# EAGLE board Negibus (EAGLE 6.6.0), part 1 of 2
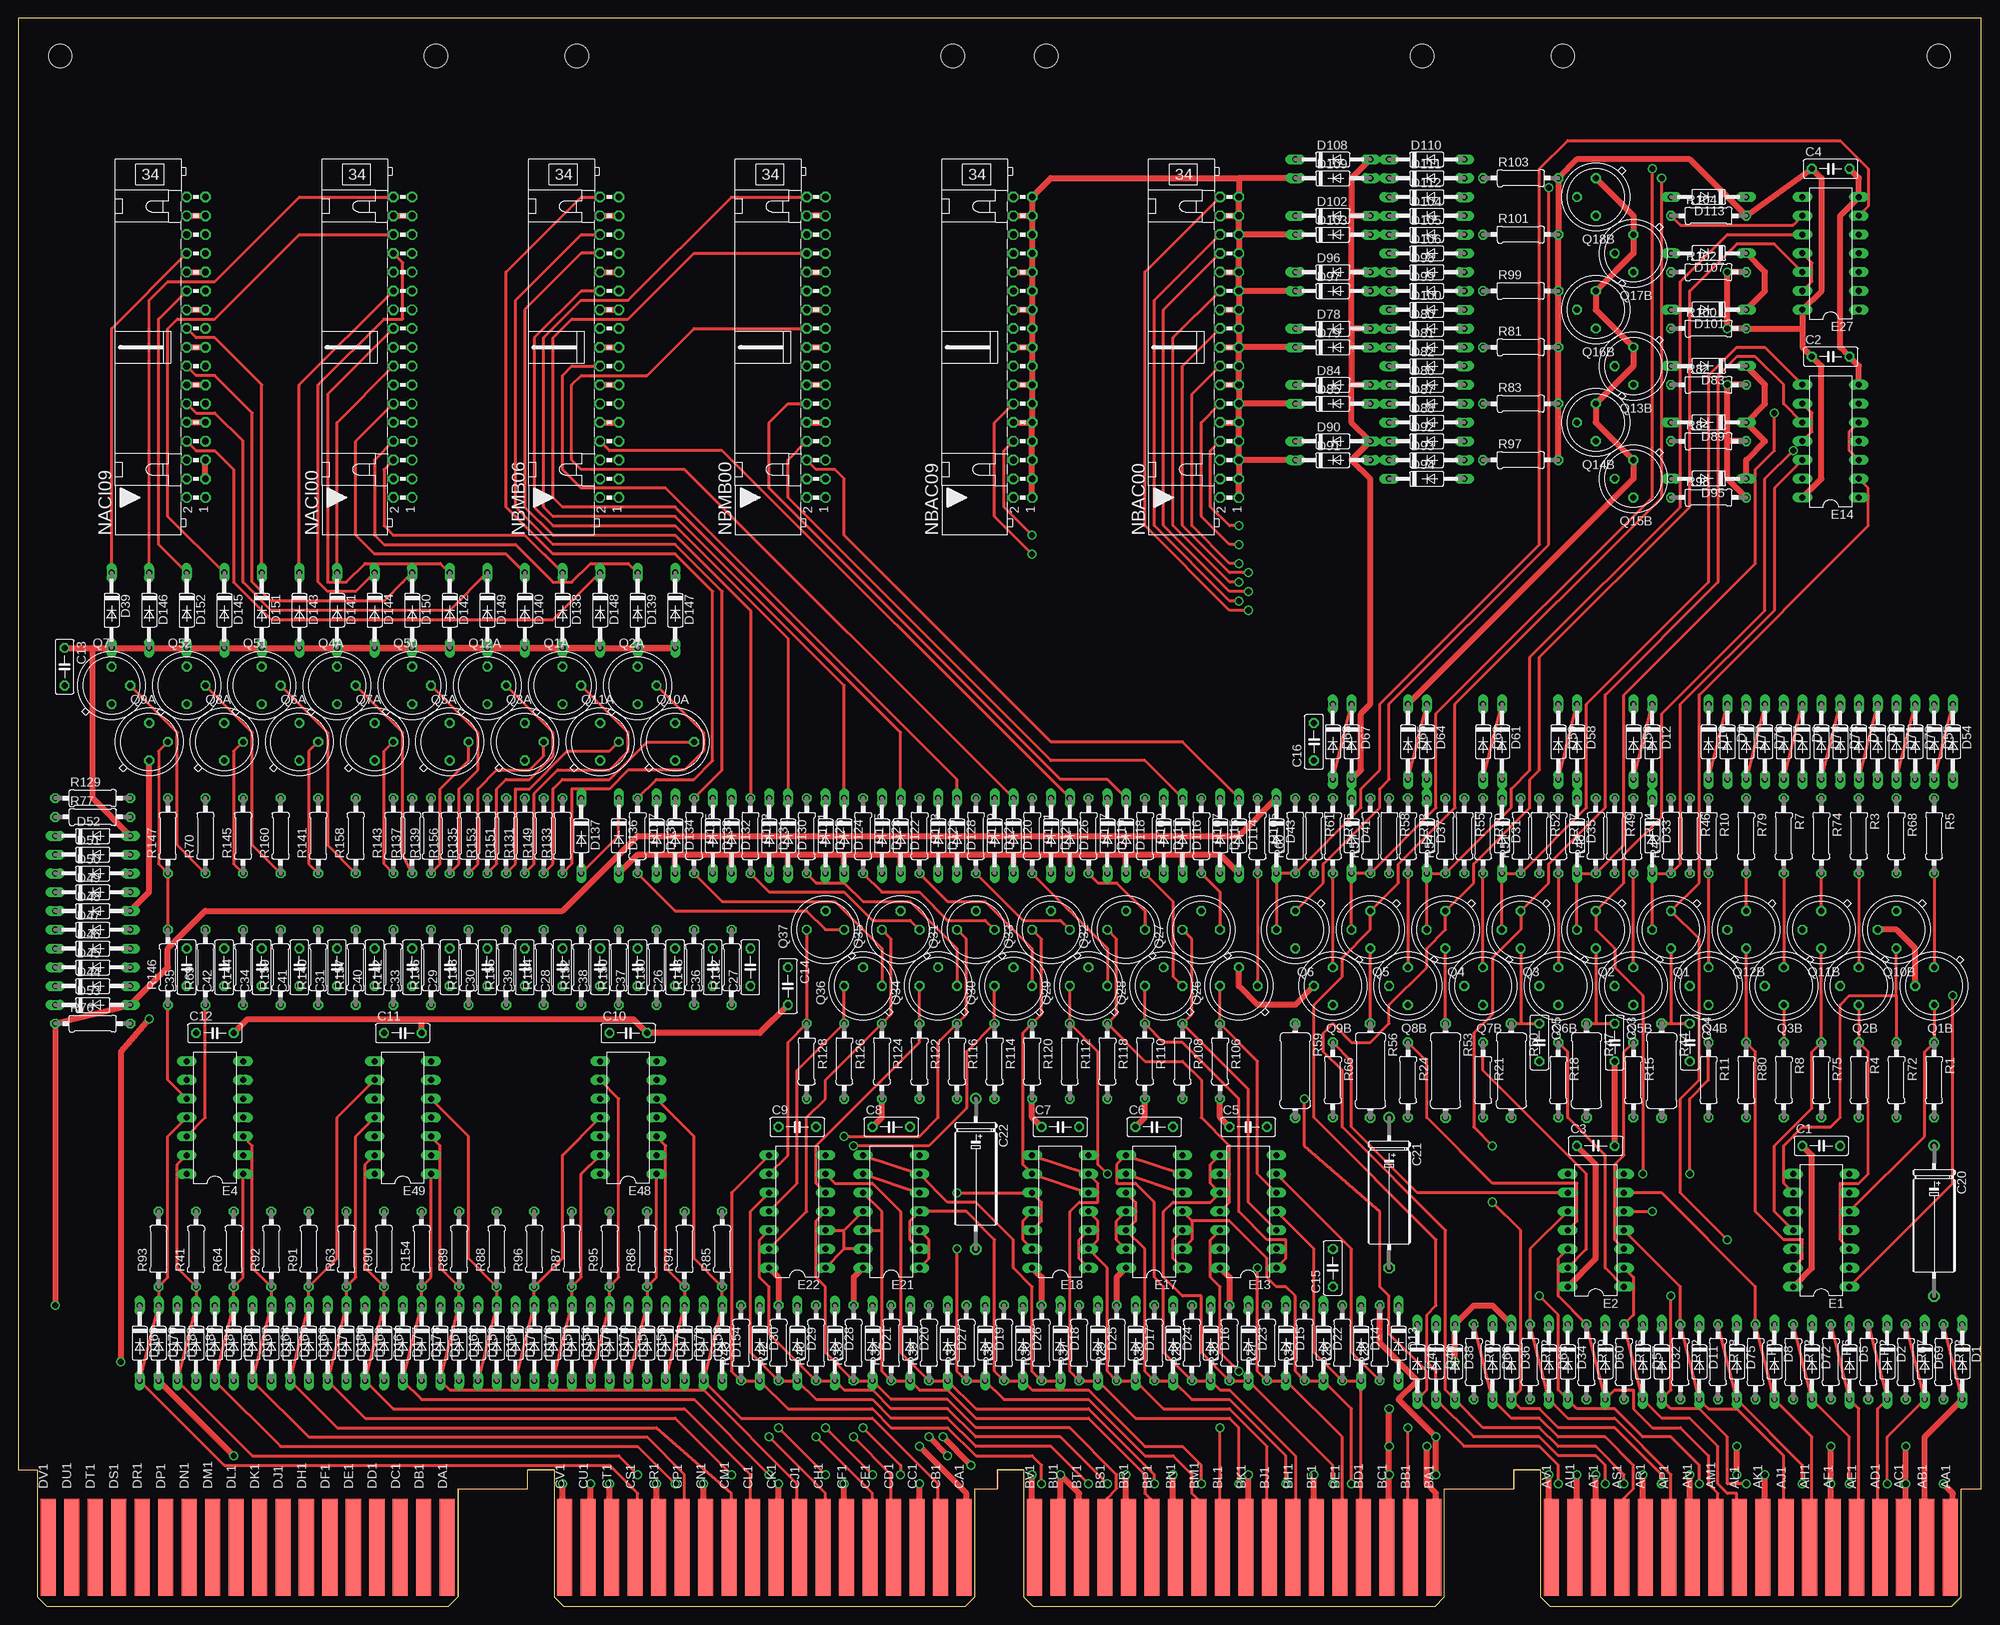
[diagram p4: board, top side]
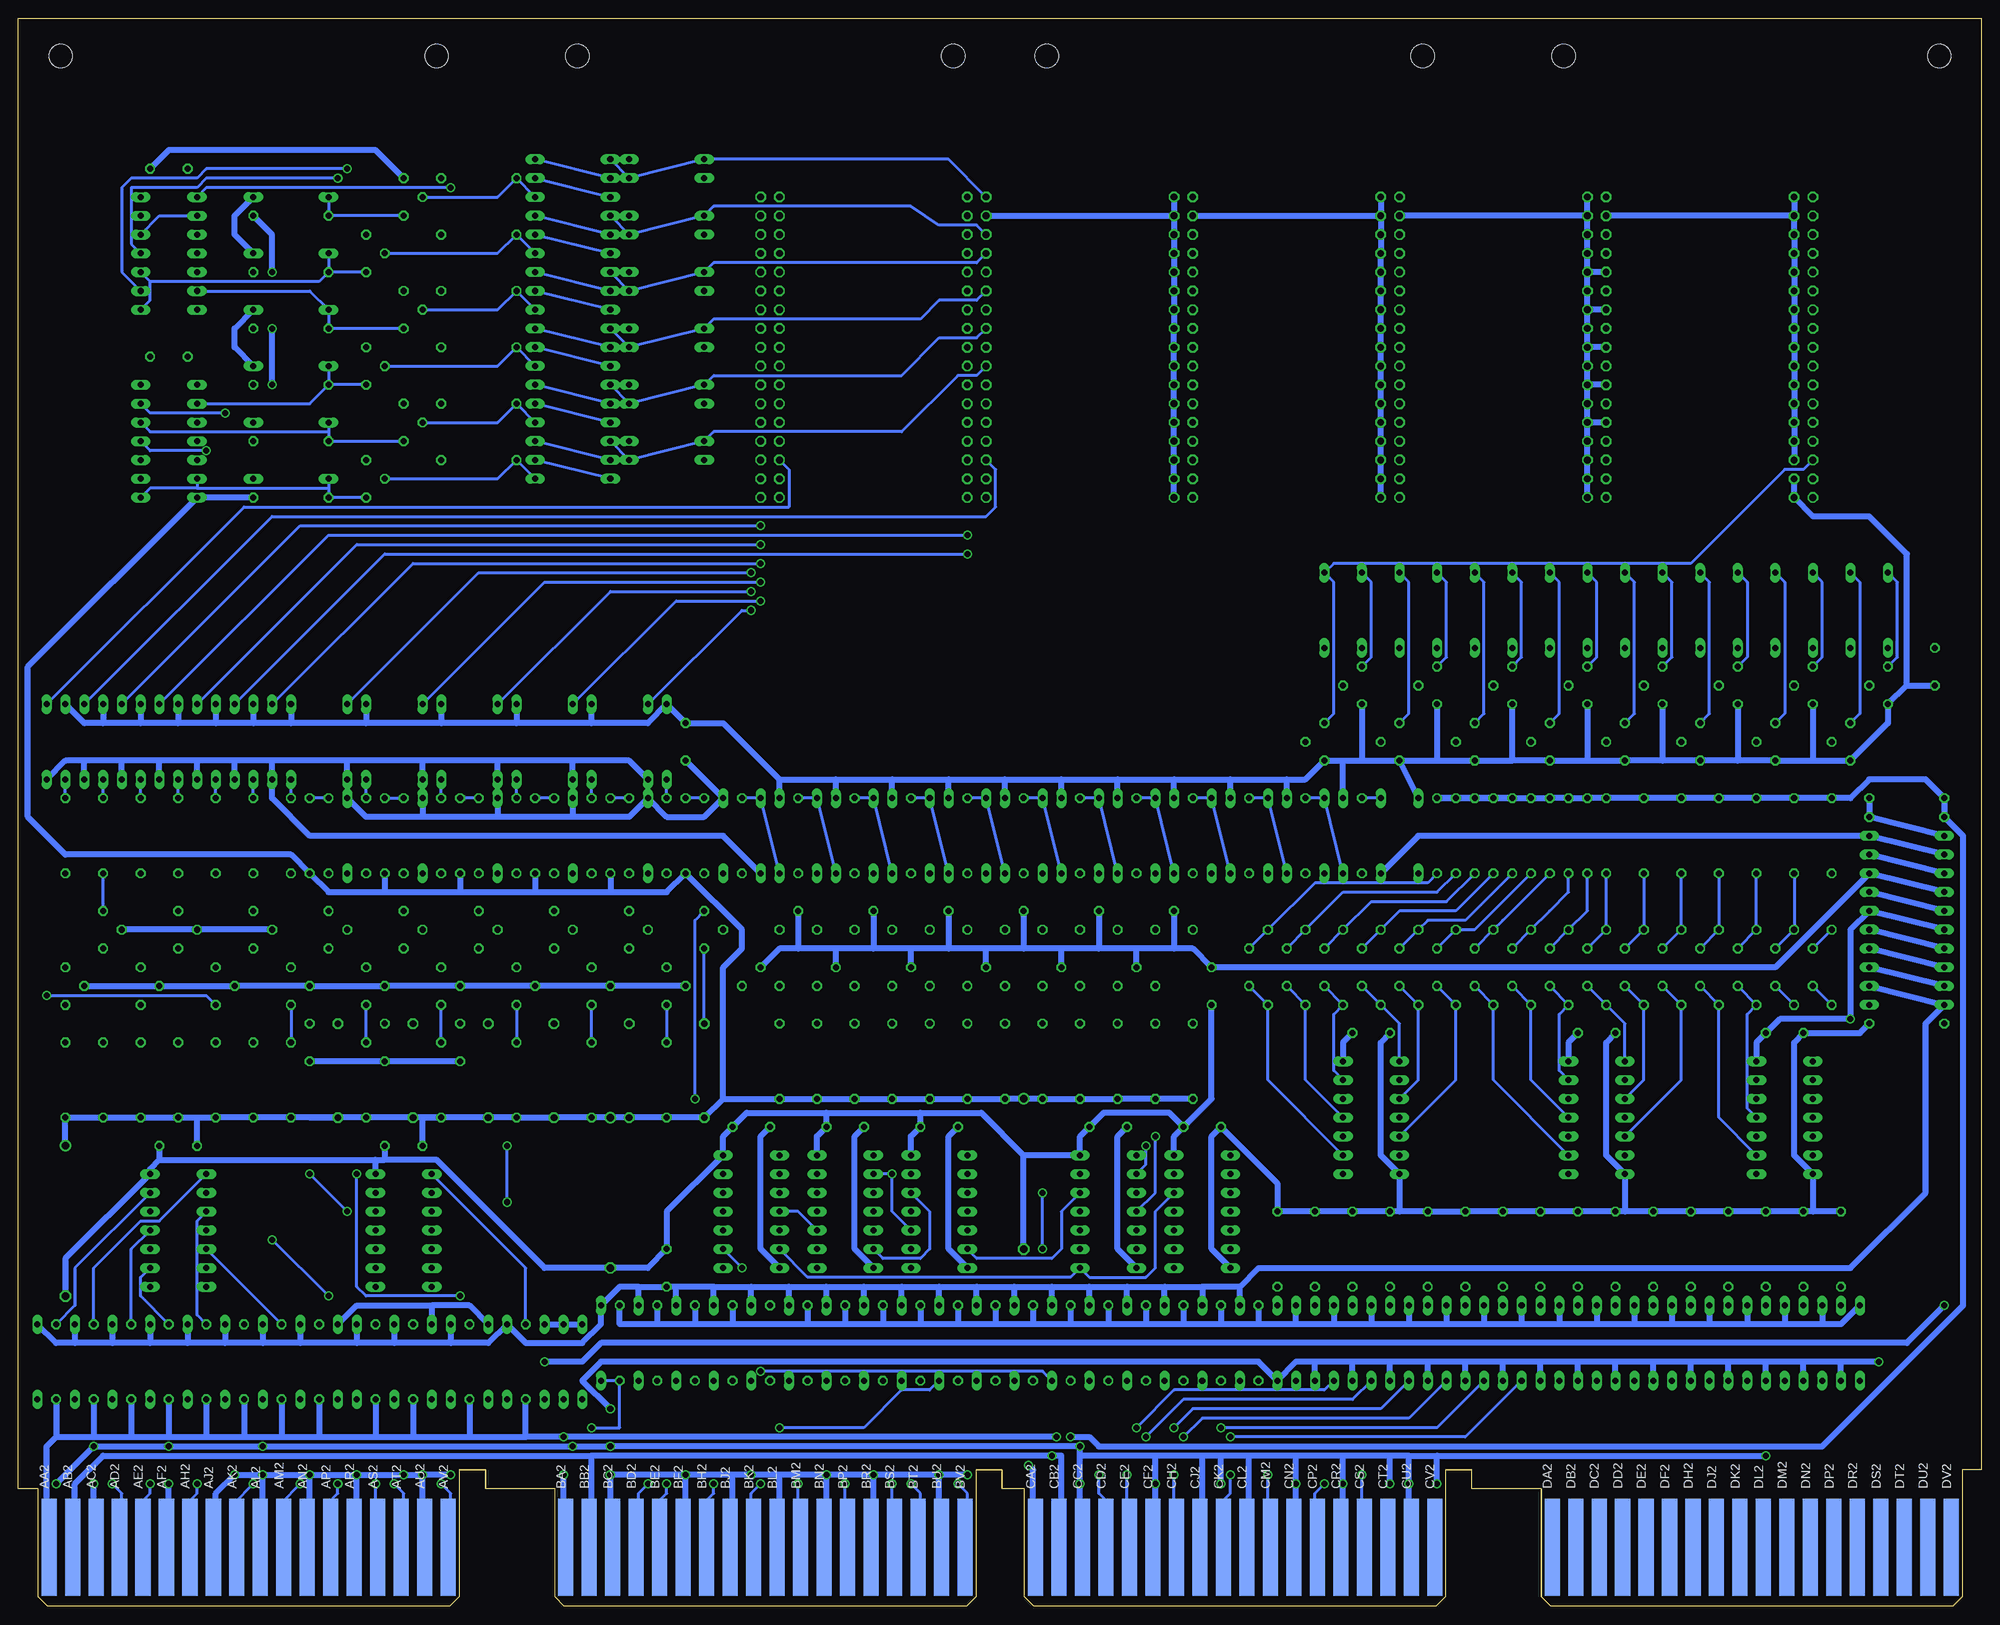
[diagram p5: board, bottom side, seen from below]

Size 265.3 x 214.63 mm. Coordinates in mm from the lower left corner, seen from the top.
Copper layers (1+16): Top 0.035mm / dielectric 1.5mm / Bottom 0.035mm
Design rules "16mils": minimum track width 16mil, minimum drill 32mil, track to track 15mil, track to pad 10mil, pad to pad 10mil, via to via 10mil, smd to smd 10mil, copper to edge 13mil, drill to drill 10mil, minimum pad ring 10mil, minimum via ring 8mil, stop-mask expansion 0mil, vias tented up to drill 0mil, thermal gap 10mil
Net classes: 1 power: width 0.813 mm

## Footprints (pad centres in the part's own frame; a part is rotated, then mirrored left to right if it is on the bottom)
C050-025X075 = drill 0.813 octagon: 1 -2.54,0; 2 2.54,0
E12-8 = drill 1.016: + -10.16,0 | drill 1.016 octagon: - 10.16,0
DO35-10 = drill 0.813 long: A 5.08,0; C -5.08,0
DIL14 = drill 0.813 long: 1 -7.62,-3.81; 2 -5.08,-3.81; 3 -2.54,-3.81; 4 0,-3.81; 5 2.54,-3.81; 6 5.08,-3.81; 7 7.62,-3.81; 8 7.62,3.81; 9 5.08,3.81; 10 2.54,3.81; 11 0,3.81; 12 -2.54,3.81; 13 -5.08,3.81; 14 -7.62,3.81
ML34L = drill 0.914 octagon: 1 -20.32,-1.27; 2 -20.32,1.27; 3 -17.78,-1.27; 4 -17.78,1.27; 5 -15.24,-1.27; 6 -15.24,1.27; 7 -12.7,-1.27; 8 -12.7,1.27; 9 -10.16,-1.27; 10 -10.16,1.27; 11 -7.62,-1.27; 12 -7.62,1.27; 13 -5.08,-1.27; 14 -5.08,1.27; 15 -2.54,-1.27; 16 -2.54,1.27; 17 0,-1.27; 18 0,1.27; 19 2.54,-1.27; 20 2.54,1.27; 21 5.08,-1.27; 22 5.08,1.27; 23 7.62,-1.27; 24 7.62,1.27; 25 10.16,-1.27; 26 10.16,1.27; 27 12.7,-1.27; 28 12.7,1.27; 29 15.24,-1.27; 30 15.24,1.27; 31 17.78,-1.27; 32 17.78,1.27; 33 20.32,-1.27; 34 20.32,1.27
TO5 = drill 0.813 octagon: 1 0,-2.54; 2 2.54,0; 3 0,2.54
TO39 = drill 0.813 octagon: 1 0,-2.54; 2 2.54,0; 3 0,2.54
0207/10 = drill 0.813 octagon: 1 -5.08,0; 2 5.08,0
0411/12 = drill 0.914 octagon: 1 -6.35,0; 2 6.35,0
OMNIBUS = hole 3.175: 208.915,209.55; 259.715,209.55; 189.865,209.55; 139.065,209.55; 75.616,209.55; 126.416,209.55; 56.566,209.55; 5.766,209.55
EDGE-CON8 = smd 2.032 x 13.106: AA1 261.303,7.938; AB1 258.127,7.938; AC1 254.952,7.938; AD1 251.778,7.938; AE1 248.602,7.938; AF1 245.428,7.938; AH1 242.252,7.938; AJ1 239.077,7.938; AK1 235.903,7.938; AL1 232.727,7.938; AM1 229.553,7.938; AN1 226.377,7.938; AP1 223.202,7.938; AR1 220.028,7.938; AS1 216.852,7.938; AT1 213.678,7.938; AU1 210.502,7.938; AV1 207.327,7.938; BA1 191.452,7.938; BB1 188.278,7.938; BC1 185.102,7.938; BD1 181.928,7.938; BE1 178.752,7.938; BF1 175.577,7.938; BH1 172.403,7.938; BJ1 169.227,7.938; BK1 166.053,7.938; BL1 162.877,7.938; BM1 159.702,7.938; BN1 156.528,7.938; BP1 153.352,7.938; BR1 150.178,7.938; BS1 147.002,7.938; BT1 143.827,7.938; BU1 140.653,7.938; BV1 137.477,7.938; CA1 127.953,7.938; CB1 124.778,7.938; CC1 121.603,7.938; CD1 118.427,7.938; CE1 115.252,7.938; CF1 112.078,7.938; CH1 108.903,7.938; CJ1 105.728,7.938; CK1 102.552,7.938; CL1 99.377,7.938; CM1 96.203,7.938; CN1 93.028,7.938; CP1 89.853,7.938; CR1 86.677,7.938; CS1 83.502,7.938; CT1 80.328,7.938; CU1 77.153,7.938; CV1 73.978,7.938; DA1 58.102,7.938; DB1 54.928,7.938; DC1 51.752,7.938; DD1 48.578,7.938; DE1 45.403,7.938; DF1 42.227,7.938; DH1 39.053,7.938; DJ1 35.877,7.938; DK1 32.703,7.938; DL1 29.527,7.938; DM1 26.352,7.938; DN1 23.177,7.938; DP1 20.003,7.938; DR1 16.828,7.938; DS1 13.652,7.938; DT1 10.477,7.938; DU1 7.303,7.938; DV1 4.128,7.938 | smd 2.032 x 13.106 bottom: AA2 261.303,7.938; AB2 258.127,7.938; AC2 254.952,7.938; AD2 251.778,7.938; AE2 248.602,7.938; AF2 245.428,7.938; AH2 242.252,7.938; AJ2 239.077,7.938; AK2 235.903,7.938; AL2 232.727,7.938; AM2 229.553,7.938; AN2 226.377,7.938; AP2 223.202,7.938; AR2 220.028,7.938; AS2 216.852,7.938; AT2 213.678,7.938; AU2 210.502,7.938; AV2 207.327,7.938; BA2 191.452,7.938; BB2 188.278,7.938; BC2 185.102,7.938; BD2 181.928,7.938; BE2 178.752,7.938; BF2 175.577,7.938; BH2 172.403,7.938; BJ2 169.227,7.938; BK2 166.053,7.938; BL2 162.877,7.938; BM2 159.702,7.938; BN2 156.528,7.938; BP2 153.352,7.938; BR2 150.178,7.938; BS2 147.002,7.938; BT2 143.827,7.938; BU2 140.653,7.938; BV2 137.477,7.938; CA2 127.953,7.938; CB2 124.778,7.938; CC2 121.603,7.938; CD2 118.427,7.938; CE2 115.252,7.938; CF2 112.078,7.938; CH2 108.903,7.938; CJ2 105.728,7.938; CK2 102.552,7.938; CL2 99.377,7.938; CM2 96.203,7.938; CN2 93.028,7.938; CP2 89.853,7.938; CR2 86.677,7.938; CS2 83.502,7.938; CT2 80.328,7.938; CU2 77.153,7.938; CV2 73.978,7.938; DA2 58.102,7.938; DB2 54.928,7.938; DC2 51.752,7.938; DD2 48.578,7.938; DE2 45.403,7.938; DF2 42.227,7.938; DH2 39.053,7.938; DJ2 35.877,7.938; DK2 32.703,7.938; DL2 29.527,7.938; DM2 26.352,7.938; DN2 23.177,7.938; DP2 20.003,7.938; DR2 16.828,7.938; DS2 13.652,7.938; DT2 10.477,7.938; DU2 7.303,7.938; DV2 4.128,7.938

## Placement (x,y rotation side)
C1  .01uF  [C050-025X075]  243.71,62.23 0 top
C2  .01uF  [C050-025X075]  244.98,168.91 0 top
C3  .01uF  [C050-025X075]  213.23,62.23 0 top
C4  .01uF  [C050-025X075]  244.98,194.31 0 top
C5  .01uF  [C050-025X075]  166.24,64.77 0 top
C6  .01uF  [C050-025X075]  153.54,64.77 0 top
C7  .01uF  [C050-025X075]  140.84,64.77 0 top
C8  .01uF  [C050-025X075]  117.98,64.77 0 top
C9  .01uF  [C050-025X075]  105.28,64.77 0 top
C10  .01uF  [C050-025X075]  82.42,77.47 0 top
C11  .01uF  [C050-025X075]  51.94,77.47 0 top
C12  .01uF  [C050-025X075]  26.54,77.47 0 top
C13  .01uF  [C050-025X075]  6.22,127 270 top
C14  .01uF  [C050-025X075]  104.01,83.82 270 top
C15  .01uF  [C050-025X075]  177.67,45.72 90 top
C16  .01uF  [C050-025X075]  175.13,116.84 90 top
C20  6.8uF  [E12-8]  258.95,52.07 270 top
C21  6.8uF  [E12-8]  185.29,55.88 270 top
C22  6.8uF  [E12-8]  129.41,58.42 270 top
C23  .01uF  [C050-025X075]  215.77,76.2 270 top
C24  .01uF  [C050-025X075]  225.93,76.2 270 top
C25  .01uF  [C050-025X075]  205.61,76.2 270 top
C26  15pf  [C050-025X075]  88.77,86.36 90 top
C27  15pf  [C050-025X075]  98.93,86.36 90 top
C28  15pf  [C050-025X075]  73.53,86.36 90 top
C29  15pf  [C050-025X075]  58.29,86.36 90 top
C30  15pf  [C050-025X075]  63.37,86.36 90 top
C31  15pf  [C050-025X075]  43.05,86.36 90 top
C33  15pf  [C050-025X075]  53.21,86.36 90 top
C34  15pf  [C050-025X075]  32.89,86.36 90 top
C35  15pf  [C050-025X075]  22.73,86.36 90 top
C36  15pf  [C050-025X075]  93.85,86.36 90 top
C37  15pf  [C050-025X075]  83.69,86.36 90 top
C38  15pf  [C050-025X075]  78.61,86.36 90 top
C39  15pf  [C050-025X075]  68.45,86.36 90 top
C40  15pf  [C050-025X075]  48.13,86.36 90 top
C41  15pf  [C050-025X075]  37.97,86.36 90 top
C42  15pf  [C050-025X075]  27.81,86.36 90 top
D1  1N3606  [DO35-10]  262.76,33.02 270 top
D2  1N3606  [DO35-10]  252.6,33.02 270 top
D3  D664  [DO35-10]  251.33,116.84 270 top
D4  D664  [DO35-10]  248.79,116.84 270 top
D5  1N3606  [DO35-10]  247.52,33.02 270 top
D6  D664  [DO35-10]  241.17,116.84 270 top
D7  D664  [DO35-10]  238.63,116.84 270 top
D8  1N3606  [DO35-10]  237.36,33.02 270 top
D9  D664  [DO35-10]  231.01,116.84 270 top
D10  D664  [DO35-10]  228.47,116.84 270 top
D11  1N3606  [DO35-10]  227.2,33.02 270 top
D12  D664  [DO35-10]  220.85,116.84 270 top
D13  1N3606  [DO35-10]  186.56,35.56 270 top
D14  1N3606  [DO35-10]  181.48,35.56 270 top
D15  1N3606  [DO35-10]  171.32,35.56 270 top
D16  1N3606  [DO35-10]  161.16,35.56 270 top
D17  1N3606  [DO35-10]  151,35.56 270 top
D18  1N3606  [DO35-10]  140.84,35.56 270 top
D19  1N3606  [DO35-10]  130.68,35.56 270 top
D20  1N3606  [DO35-10]  120.52,35.56 270 top
D21  1N3606  [DO35-10]  115.44,35.56 270 top
D22  1N3606  [DO35-10]  176.4,35.56 270 top
D23  1N3606  [DO35-10]  166.24,35.56 270 top
D24  1N3606  [DO35-10]  156.08,35.56 270 top
D25  1N3606  [DO35-10]  145.92,35.56 270 top
D26  1N3606  [DO35-10]  135.76,35.56 270 top
D27  1N3606  [DO35-10]  125.6,35.56 270 top
D28  1N3606  [DO35-10]  110.36,35.56 270 top
D29  1N3606  [DO35-10]  105.28,35.56 270 top
D30  1N3606  [DO35-10]  100.2,35.56 270 top
D31  1N3606  [DO35-10]  200.53,104.14 270 top
D32  1N3606  [DO35-10]  222.12,33.02 270 top
D33  1N3606  [DO35-10]  220.85,104.14 270 top
D34  1N3606  [DO35-10]  209.42,33.02 270 top
D35  1N3606  [DO35-10]  210.69,104.14 270 top
D36  1N3606  [DO35-10]  201.8,33.02 270 top
D37  1N3606  [DO35-10]  190.37,104.14 270 top
D38  1N3606  [DO35-10]  194.18,33.02 270 top
D39  D664  [DO35-10]  12.57,134.62 270 top
D40  1N3606  [DO35-10]  191.64,33.02 270 top
D41  1N3606  [DO35-10]  180.21,104.14 270 top
D42  1N3606  [DO35-10]  189.1,33.02 270 top
D43  1N3606  [DO35-10]  170.05,104.14 270 top
D44  1N645  [DO35-10]  10.03,83.82 0 top
D45  1N645  [DO35-10]  10.03,86.36 0 top
D46  1N645  [DO35-10]  10.03,88.9 0 top
D47  1N645  [DO35-10]  10.03,91.44 0 top
D48  1N645  [DO35-10]  10.03,93.98 0 top
D49  1N645  [DO35-10]  10.03,96.52 0 top
D50  1N645  [DO35-10]  10.03,99.06 0 top
D51  1N645  [DO35-10]  10.03,101.6 0 top
D52  1N645  [DO35-10]  10.03,104.14 0 top
D53  1N645  [DO35-10]  10.03,81.28 0 top
D54  D664  [DO35-10]  261.49,116.84 270 top
D55  D664  [DO35-10]  258.95,116.84 270 top
D56  D664  [DO35-10]  218.31,116.84 270 top
D57  1N3606  [DO35-10]  219.58,33.02 270 top
D58  D664  [DO35-10]  210.69,116.84 270 top
D59  D664  [DO35-10]  208.15,116.84 270 top
D60  1N3606  [DO35-10]  214.5,33.02 270 top
D61  D664  [DO35-10]  200.53,116.84 270 top
D62  D664  [DO35-10]  197.99,116.84 270 top
D63  1N3606  [DO35-10]  206.88,33.02 270 top
D64  D664  [DO35-10]  190.37,116.84 270 top
D65  D664  [DO35-10]  187.83,116.84 270 top
D66  1N3606  [DO35-10]  199.26,33.02 270 top
D67  D664  [DO35-10]  180.21,116.84 270 top
D68  D664  [DO35-10]  177.67,116.84 270 top
D69  1N3606  [DO35-10]  257.68,33.02 270 top
D70  D664  [DO35-10]  256.41,116.84 270 top
D71  D664  [DO35-10]  253.87,116.84 270 top
D72  1N3606  [DO35-10]  242.44,33.02 270 top
D73  D664  [DO35-10]  246.25,116.84 270 top
D74  D664  [DO35-10]  243.71,116.84 270 top
D75  1N3606  [DO35-10]  232.28,33.02 270 top
D76  D664  [DO35-10]  236.09,116.84 270 top
D77  D664  [DO35-10]  233.55,116.84 270 top
D78  D664  [DO35-10]  177.67,172.72 0 top
D79  D664  [DO35-10]  177.67,170.18 0 top
D80  D664  [DO35-10]  190.37,172.72 0 top
D81  D664  [DO35-10]  190.37,170.18 0 top
D82  D664  [DO35-10]  190.37,167.64 0 top
D83  D664  [DO35-10]  228.47,167.64 180 top
D84  D664  [DO35-10]  177.67,165.1 0 top
D85  D664  [DO35-10]  177.67,162.56 0 top
D86  D664  [DO35-10]  190.37,165.1 0 top
D87  D664  [DO35-10]  190.37,162.56 0 top
D88  D664  [DO35-10]  190.37,160.02 0 top
D89  D664  [DO35-10]  228.47,160.02 180 top
D90  D664  [DO35-10]  177.67,157.48 0 top
D91  D664  [DO35-10]  177.67,154.94 0 top
D92  D664  [DO35-10]  190.37,157.48 0 top
D93  D664  [DO35-10]  190.37,154.94 0 top
D94  D664  [DO35-10]  190.37,152.4 0 top
D95  D664  [DO35-10]  228.47,152.4 180 top
D96  D664  [DO35-10]  177.67,180.34 0 top
D97  D664  [DO35-10]  177.67,177.8 0 top
D98  D664  [DO35-10]  190.37,180.34 0 top
D99  D664  [DO35-10]  190.37,177.8 0 top
D100  D664  [DO35-10]  190.37,175.26 0 top
D101  D664  [DO35-10]  228.47,175.26 180 top
D102  D664  [DO35-10]  177.67,187.96 0 top
D103  D664  [DO35-10]  177.67,185.42 0 top
D104  D664  [DO35-10]  190.37,187.96 0 top
D105  D664  [DO35-10]  190.37,185.42 0 top
D106  D664  [DO35-10]  190.37,182.88 0 top
D107  D664  [DO35-10]  228.47,182.88 180 top
D108  D664  [DO35-10]  177.67,195.58 0 top
D109  D664  [DO35-10]  177.67,193.04 0 top
D110  D664  [DO35-10]  190.37,195.58 0 top
D111  D664  [DO35-10]  190.37,193.04 0 top
D112  D664  [DO35-10]  190.37,190.5 0 top
D113  D664  [DO35-10]  228.47,190.5 180 top
D114  D664  [DO35-10]  164.97,104.14 270 top
D115  D664  [DO35-10]  162.43,104.14 270 top
D116  D664  [DO35-10]  157.35,104.14 270 top
D117  D664  [DO35-10]  154.81,104.14 270 top
D118  D664  [DO35-10]  149.73,104.14 270 top
D119  D664  [DO35-10]  147.19,104.14 270 top
D120  D664  [DO35-10]  134.49,104.14 270 top
D121  D664  [DO35-10]  131.95,104.14 270 top
D122  D664  [DO35-10]  119.25,104.14 270 top
D123  D664  [DO35-10]  116.71,104.14 270 top
D124  D664  [DO35-10]  111.63,104.14 270 top
D125  D664  [DO35-10]  109.09,104.14 270 top
D126  D664  [DO35-10]  142.11,104.14 270 top
D127  D664  [DO35-10]  139.57,104.14 270 top
D128  D664  [DO35-10]  126.87,104.14 270 top
D129  D664  [DO35-10]  124.33,104.14 270 top
D130  D664  [DO35-10]  104.01,104.14 270 top
D131  D664  [DO35-10]  101.47,104.14 270 top
D132  D664  [DO35-10]  96.39,104.14 270 top
D133  D664  [DO35-10]  93.85,104.14 270 top
D134  D664  [DO35-10]  88.77,104.14 270 top
D135  D664  [DO35-10]  86.23,104.14 270 top
D136  D664  [DO35-10]  81.15,104.14 270 top
D137  D664  [DO35-10]  76.07,104.14 270 top
D138  D664  [DO35-10]  73.53,134.62 270 top
D139  D664  [DO35-10]  83.69,134.62 270 top
D140  D664  [DO35-10]  68.45,134.62 270 top
D141  D664  [DO35-10]  43.05,134.62 270 top
D142  D664  [DO35-10]  58.29,134.62 270 top
D143  D664  [DO35-10]  37.97,134.62 270 top
D144  D664  [DO35-10]  48.13,134.62 270 top
D145  D664  [DO35-10]  27.81,134.62 270 top
D146  D664  [DO35-10]  17.65,134.62 270 top
D147  D664  [DO35-10]  88.77,134.62 270 top
D148  D664  [DO35-10]  78.61,134.62 270 top
D149  D664  [DO35-10]  63.37,134.62 270 top
D150  D664  [DO35-10]  53.21,134.62 270 top
D151  D664  [DO35-10]  32.89,134.62 270 top
D152  D664  [DO35-10]  22.73,134.62 270 top
D153  D664  [DO35-10]  92.58,35.56 270 top
D154  D664  [DO35-10]  95.12,35.56 270 top
D155  D664  [DO35-10]  82.42,35.56 270 top
D156  D664  [DO35-10]  84.96,35.56 270 top
D157  D664  [DO35-10]  72.26,35.56 270 top
D158  D664  [DO35-10]  74.8,35.56 270 top
D159  D664  [DO35-10]  62.1,35.56 270 top
D160  D664  [DO35-10]  64.64,35.56 270 top
D161  D664  [DO35-10]  57.02,35.56 270 top
D162  D664  [DO35-10]  59.56,35.56 270 top
D163  D664  [DO35-10]  46.86,35.56 270 top
D164  D664  [DO35-10]  49.4,35.56 270 top
D165  D664  [DO35-10]  36.7,35.56 270 top
D166  D664  [DO35-10]  39.24,35.56 270 top
D167  D664  [DO35-10]  31.62,35.56 270 top
D168  D664  [DO35-10]  34.16,35.56 270 top
D169  D664  [DO35-10]  16.38,35.56 270 top
D170  D664  [DO35-10]  18.92,35.56 270 top
D171  D664  [DO35-10]  87.5,35.56 270 top
D172  D664  [DO35-10]  90.04,35.56 270 top
D173  D664  [DO35-10]  77.34,35.56 270 top
D174  D664  [DO35-10]  79.88,35.56 270 top
D175  D664  [DO35-10]  67.18,35.56 270 top
D176  D664  [DO35-10]  69.72,35.56 270 top
D177  D664  [DO35-10]  51.94,35.56 270 top
D178  D664  [DO35-10]  54.48,35.56 270 top
D179  D664  [DO35-10]  41.78,35.56 270 top
D180  D664  [DO35-10]  44.32,35.56 270 top
D181  D664  [DO35-10]  26.54,35.56 270 top
D182  D664  [DO35-10]  29.08,35.56 270 top
D183  D664  [DO35-10]  21.46,35.56 270 top
D184  D664  [DO35-10]  24,35.56 270 top
E1  7417N  [DIL14]  243.71,50.8 90 top
E2  7417N  [DIL14]  213.23,50.8 90 top
E4  7404N  [DIL14]  26.54,66.04 90 top
E13  7417N  [DIL14]  166.24,53.34 90 top
E14  7417N  [DIL14]  244.98,157.48 90 top
E17  7416N  [DIL14]  153.54,53.34 90 top
E18  7417N  [DIL14]  140.84,53.34 90 top
E21  7416N  [DIL14]  117.98,53.34 90 top
E22  7417N  [DIL14]  105.28,53.34 90 top
E27  7417N  [DIL14]  244.98,182.88 90 top
E48  7404N  [DIL14]  82.42,66.04 90 top
E49  7404N  [DIL14]  51.94,66.04 90 top
NACI00  [ML34L]  51.94,170.18 90 top
NACI09  [ML34L]  24,170.18 90 top
NBAC00  [ML34L]  163.7,170.18 90 top
NBAC09  [ML34L]  135.76,170.18 90 top
NBMB00  [ML34L]  107.82,170.18 90 top
NBMB06  [ML34L]  79.88,170.18 90 top
Q1  2N3009B  [TO5]  223.39,91.44 180 top
Q1A  2N3639B  [TO39]  73.53,124.46 0 top
Q1B  2N3009B  [TO39]  258.95,83.82 180 top
Q2  2N3009B  [TO5]  213.23,91.44 180 top
Q2A  2N3639B  [TO39]  83.69,124.46 0 top
Q2B  2N3009B  [TO39]  248.79,83.82 180 top
Q3  2N3009B  [TO5]  203.07,91.44 180 top
Q3A  2N3639B  [TO39]  68.45,116.84 0 top
Q3B  2N3009B  [TO39]  238.63,83.82 180 top
Q4  2N3009B  [TO5]  192.91,91.44 180 top
Q4A  2N3639B  [TO39]  43.05,124.46 0 top
Q4B  2N3009B  [TO39]  228.47,83.82 180 top
Q5  2N3009B  [TO5]  182.75,91.44 180 top
Q5A  2N3639B  [TO39]  58.29,116.84 0 top
Q5B  2N3009B  [TO39]  218.31,83.82 180 top
Q6  2N3009B  [TO5]  172.59,91.44 180 top
Q6A  2N3639B  [TO39]  37.97,116.84 0 top
Q6B  2N3009B  [TO39]  208.15,83.82 180 top
Q7  2N3639B  [TO39]  12.57,124.46 0 top
Q7A  2N3639B  [TO39]  48.13,116.84 0 top
Q7B  2N3009B  [TO39]  197.99,83.82 180 top
Q8A  2N3639B  [TO39]  27.81,116.84 0 top
Q8B  2N3009B  [TO39]  187.83,83.82 180 top
Q9A  2N3639B  [TO39]  17.65,116.84 0 top
Q9B  2N3009B  [TO39]  177.67,83.82 180 top
Q10A  2N3639B  [TO39]  88.77,116.84 0 top
Q10B  2N3009B  [TO39]  253.87,91.44 180 top
Q11A  2N3639B  [TO39]  78.61,116.84 0 top
Q11B  2N3009B  [TO39]  243.71,91.44 180 top
Q12A  2N3639B  [TO39]  63.37,124.46 0 top
Q12B  2N3009B  [TO39]  233.55,91.44 180 top
Q13B  2N3009B  [TO39]  218.31,167.64 180 top
Q14B  2N3009B  [TO39]  213.23,160.02 180 top
Q15B  2N3009B  [TO39]  218.31,152.4 180 top
Q16B  2N3009B  [TO39]  213.23,175.26 180 top
Q17B  2N3009B  [TO39]  218.31,182.88 180 top
Q18B  2N3009B  [TO39]  213.23,190.5 180 top
Q26  2N3009B  [TO39]  164.97,83.82 90 top
Q27  2N3009B  [TO39]  159.89,91.44 90 top
Q28  2N3009B  [TO39]  154.81,83.82 90 top
Q29  2N3009B  [TO39]  144.65,83.82 90 top
Q30  2N3009B  [TO39]  134.49,83.82 90 top
Q31  2N3009B  [TO39]  129.41,91.44 90 top
Q32  2N3009B  [TO39]  149.73,91.44 90 top
Q33  2N3009B  [TO39]  139.57,91.44 90 top
Q34  2N3009B  [TO39]  124.33,83.82 90 top
Q35  2N3009B  [TO39]  119.25,91.44 90 top
Q36  2N3009B  [TO39]  114.17,83.82 90 top
Q37  2N3009B  [TO39]  109.09,91.44 90 top
Q50  2N3639B  [TO39]  53.21,124.46 0 top
Q51  2N3639B  [TO39]  32.89,124.46 0 top
Q52  2N3639B  [TO39]  22.73,124.46 0 top
R1  4.7K  [0207/10]  258.95,71.12 270 top
R2  220  [0207/10]  250.06,33.02 270 top
R3  470  [0207/10]  248.79,104.14 270 top
R4  4.7K  [0207/10]  248.79,71.12 270 top
R5  470  [0207/10]  258.95,104.14 270 top
R6  220  [0207/10]  244.98,33.02 270 top
R7  470  [0207/10]  238.63,104.14 270 top
R8  4.7K  [0207/10]  238.63,71.12 270 top
R9  220  [0207/10]  234.82,33.02 270 top
R10  470  [0207/10]  228.47,104.14 270 top
R11  4.7K  [0207/10]  228.47,71.12 270 top
R12  220  [0207/10]  224.66,33.02 270 top
R13  220  [0207/10]  260.22,33.02 270 top
R14  470  [0207/10]  218.31,104.14 270 top
R15  4.7K  [0207/10]  218.31,71.12 270 top
R16  220  [0207/10]  217.04,33.02 270 top
R17  470  [0207/10]  208.15,104.14 270 top
R18  4.7K  [0207/10]  208.15,71.12 270 top
R19  220  [0207/10]  211.96,33.02 270 top
R20  470  [0207/10]  197.99,104.14 270 top
R21  4.7K  [0207/10]  197.99,71.12 270 top
R22  220  [0207/10]  204.34,33.02 270 top
R23  470  [0207/10]  187.83,104.14 270 top
R24  4.7K  [0207/10]  187.83,71.12 270 top
R25  220  [0207/10]  184.02,35.56 90 top
R26  220  [0207/10]  178.94,35.56 90 top
R27  220  [0207/10]  168.78,35.56 90 top
R28  220  [0207/10]  158.62,35.56 90 top
R29  220  [0207/10]  148.46,35.56 90 top
R30  220  [0207/10]  138.3,35.56 90 top
R31  220  [0207/10]  128.14,35.56 90 top
R32  220  [0207/10]  117.98,35.56 90 top
R33  220  [0207/10]  112.9,35.56 90 top
R34  220  [0207/10]  173.86,35.56 90 top
R35  220  [0207/10]  163.7,35.56 90 top
R36  220  [0207/10]  153.54,35.56 90 top
R37  220  [0207/10]  143.38,35.56 90 top
R38  220  [0207/10]  133.22,35.56 90 top
R39  220  [0207/10]  123.06,35.56 90 top
R40  220  [0207/10]  107.82,35.56 90 top
R41  220  [0207/10]  24,48.26 90 top
R42  220  [0207/10]  102.74,35.56 90 top
R43  220  [0207/10]  97.66,35.56 90 top
R44  27  [0411/12]  222.12,72.39 270 top
R45  220  [0207/10]  223.39,104.14 90 top
R46  220  [0207/10]  225.93,104.14 270 top
R47  27  [0411/12]  211.96,72.39 270 top
R48  220  [0207/10]  213.23,104.14 90 top
R49  220  [0207/10]  215.77,104.14 270 top
R50  27  [0411/12]  201.8,72.39 270 top
R51  220  [0207/10]  203.07,104.14 90 top
R52  220  [0207/10]  205.61,104.14 270 top
R53  27  [0411/12]  192.91,72.39 270 top
R54  220  [0207/10]  192.91,104.14 90 top
R55  220  [0207/10]  195.45,104.14 270 top
R56  27  [0411/12]  182.75,72.39 270 top
R57  220  [0207/10]  182.75,104.14 90 top
R58  220  [0207/10]  185.29,104.14 270 top
R59  27  [0411/12]  172.59,72.39 270 top
R60  220  [0207/10]  172.59,104.14 90 top
R61  220  [0207/10]  175.13,104.14 270 top
R62  220  [0207/10]  196.72,33.02 270 top
R63  220  [0207/10]  44.32,48.26 90 top
R64  220  [0207/10]  29.08,48.26 90 top
R65  470  [0207/10]  177.67,104.14 270 top
R66  4.7K  [0207/10]  177.67,71.12 270 top
R67  220  [0207/10]  255.14,33.02 270 top
R68  470  [0207/10]  253.87,104.14 270 top
R69  1K  [0207/10]  25.27,86.36 90 top
R70  5.6K  [0207/10]  25.27,104.14 90 top
R72  4.7K  [0207/10]  253.87,71.12 270 top
R73  220  [0207/10]  239.9,33.02 270 top
R74  470  [0207/10]  243.71,104.14 270 top
R75  4.7K  [0207/10]  243.71,71.12 270 top
R76  220  [0207/10]  10.03,78.74 0 top
R77  1500  [0207/10]  10.03,106.68 0 top
R78  220  [0207/10]  229.74,33.02 270 top
R79  470  [0207/10]  233.55,104.14 270 top
R80  4.7K  [0207/10]  233.55,71.12 270 top
R81  4.7K  [0207/10]  203.07,170.18 0 top
R82  470  [0207/10]  228.47,165.1 0 top
R83  4.7K  [0207/10]  203.07,162.56 0 top
R84  470  [0207/10]  228.47,157.48 0 top
R85  220  [0207/10]  95.12,48.26 90 top
R86  220  [0207/10]  84.96,48.26 90 top
R87  220  [0207/10]  74.8,48.26 90 top
R88  220  [0207/10]  64.64,48.26 90 top
R89  220  [0207/10]  59.56,48.26 90 top
R90  220  [0207/10]  49.4,48.26 90 top
R91  220  [0207/10]  39.24,48.26 90 top
R92  220  [0207/10]  34.16,48.26 90 top
R93  220  [0207/10]  18.92,48.26 90 top
R94  220  [0207/10]  90.04,48.26 90 top
R95  220  [0207/10]  79.88,48.26 90 top
R96  220  [0207/10]  69.72,48.26 90 top
R97  4.7K  [0207/10]  203.07,154.94 0 top
R98  470  [0207/10]  228.47,149.86 0 top
R99  4.7K  [0207/10]  203.07,177.8 0 top
R100  470  [0207/10]  228.47,172.72 0 top
R101  4.7K  [0207/10]  203.07,185.42 0 top
R102  470  [0207/10]  228.47,180.34 0 top
R103  4.7K  [0207/10]  203.07,193.04 0 top
R104  470  [0207/10]  228.47,187.96 0 top
R105  470  [0207/10]  167.51,104.14 270 top
R106  4.7K  [0207/10]  162.43,73.66 270 top
R107  470  [0207/10]  159.89,104.14 270 top
R108  4.7K  [0207/10]  157.35,73.66 270 top
R109  470  [0207/10]  152.27,104.14 270 top
R110  4.7K  [0207/10]  152.27,73.66 270 top
R111  470  [0207/10]  137.03,104.14 270 top
R112  4.7K  [0207/10]  142.11,73.66 270 top
R113  470  [0207/10]  121.79,104.14 270 top
R114  4.7K  [0207/10]  131.95,73.66 270 top
R115  470  [0207/10]  114.17,104.14 270 top
R116  4.7K  [0207/10]  126.87,73.66 270 top
R117  470  [0207/10]  144.65,104.14 270 top
R118  4.7K  [0207/10]  147.19,73.66 270 top
R119  470  [0207/10]  129.41,104.14 270 top
R120  4.7K  [0207/10]  137.03,73.66 270 top
R121  470  [0207/10]  106.55,104.14 270 top
R122  4.7K  [0207/10]  121.79,73.66 270 top
R123  470  [0207/10]  98.93,104.14 270 top
R124  4.7K  [0207/10]  116.71,73.66 270 top
R125  470  [0207/10]  91.31,104.14 270 top
R126  4.7K  [0207/10]  111.63,73.66 270 top
R127  470  [0207/10]  83.69,104.14 270 top
R128  4.7K  [0207/10]  106.55,73.66 270 top
R129  1500  [0207/10]  10.03,109.22 0 top
R130  1K  [0207/10]  86.23,86.36 90 top
R131  5.6K  [0207/10]  68.45,104.14 90 top
R132  1K  [0207/10]  96.39,86.36 90 top
R133  5.6K  [0207/10]  73.53,104.14 90 top
R134  1K  [0207/10]  70.99,86.36 90 top
R135  5.6K  [0207/10]  60.83,104.14 90 top
R136  1K  [0207/10]  55.75,86.36 90 top
R137  5.6K  [0207/10]  53.21,104.14 90 top
R138  1K  [0207/10]  60.83,86.36 90 top
R139  5.6K  [0207/10]  55.75,104.14 90 top
R140  1K  [0207/10]  40.51,86.36 90 top
R141  5.6K  [0207/10]  40.51,104.14 90 top
R142  1K  [0207/10]  50.67,86.36 90 top
R143  5.6K  [0207/10]  50.67,104.14 90 top
R144  1K  [0207/10]  30.35,86.36 90 top
R145  5.6K  [0207/10]  30.35,104.14 90 top
R146  1K  [0207/10]  20.19,86.36 90 top
R147  5.6K  [0207/10]  20.19,104.14 90 top
R148  1K  [0207/10]  91.31,86.36 90 top
R149  5.6K  [0207/10]  70.99,104.14 90 top
R150  1K  [0207/10]  81.15,86.36 90 top
R151  5.6K  [0207/10]  65.91,104.14 90 top
R152  1K  [0207/10]  76.07,86.36 90 top
R153  5.6K  [0207/10]  63.37,104.14 90 top
R154  220  [0207/10]  54.48,48.26 90 top
R155  1K  [0207/10]  65.91,86.36 90 top
R156  5.6K  [0207/10]  58.29,104.14 90 top
R157  1K  [0207/10]  45.59,86.36 90 top
R158  5.6K  [0207/10]  45.59,104.14 90 top
R159  1K  [0207/10]  35.43,86.36 90 top
R160  5.6K  [0207/10]  35.43,104.14 90 top
U$1  OUTLINE-OMNIBUS  [OMNIBUS]  -0.13,0 0 top
U$3  QUAD  [EDGE-CON8]  -0.13,0 0 top